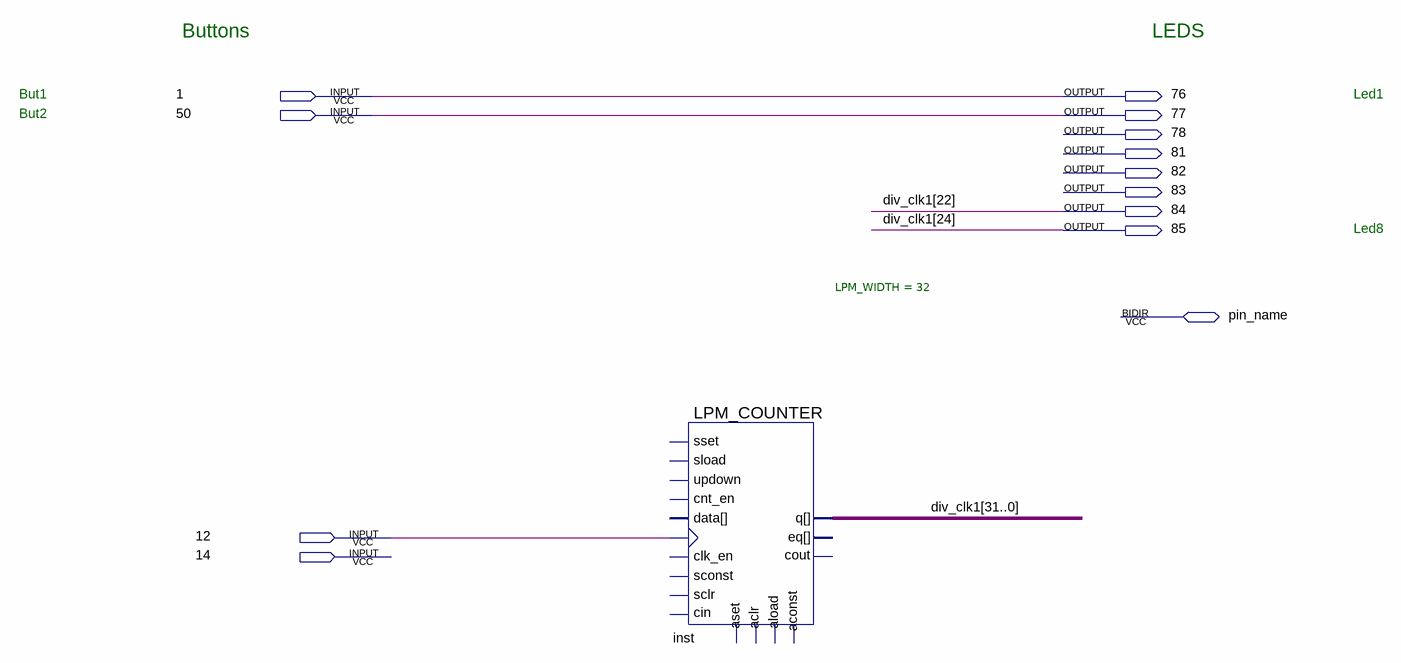
[diagram p0: schematic sheet]
// Quartus schematic Qua13_BRD_EPM240T100I5N.bdf as structural Verilog: 1 symbols, 13 pins
module Qua13_BRD_EPM240T100I5N (
  input  \1 ,
  input  \50 ,
  input  \12 ,
  input  \14 ,
  inout  pin_name,
  output \76 ,
  output \77 ,
  output \78 ,
  output \81 ,
  output \82 ,
  output \83 ,
  output \84 ,
  output \85 
);

  wire [31:0] div_clk1;

  LPM_COUNTER #(.LPM_WIDTH(32)) inst (
    .clock(\12 ), .q({div_clk1[31:25], \85 , div_clk1[23], \84 , div_clk1[21:0]}));  // open: sset, sload, updown, cnt_en, data, clk_en, sconst, sclr, aload, aclr, aset, aconst, cin, eq, cout

  assign \76  = \1 ;
  assign \77  = \50 ;

  // Other names for the same wires on the sheet: div_clk1 (some bits) = {\85 , \84 }

  // Notes on the sheet:
  //   Buttons
  //   LEDS
  //   But1
  //   Led1
  //   But2
  //   Led8
endmodule
